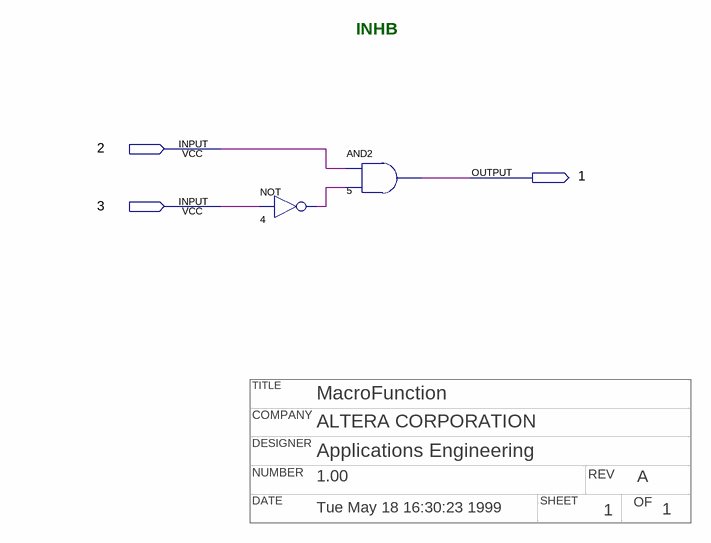
[diagram p0: schematic sheet]
// Quartus schematic inhb.bdf as structural Verilog: 2 symbols, 3 pins
// Title block: TITLE: MacroFunction; COMPANY: ALTERA CORPORATION; DESIGNER: Applications Engineering; NUMBER: 1.00; REV: A; DATE: Tue May 18 16:30:23 1999; SHEET: 1; OF: 1
module inhb (
  input  \2 ,
  input  \3 ,
  output \1 
);

  wire n4_out;

  not u_4 (n4_out, \3 );
  and u_5 (\1 , \2 , n4_out);

  // Notes on the sheet:
  //   INHB
endmodule
